# EAGLE schematic SSI2131-Proto-PCB (EAGLE 7.5.0)
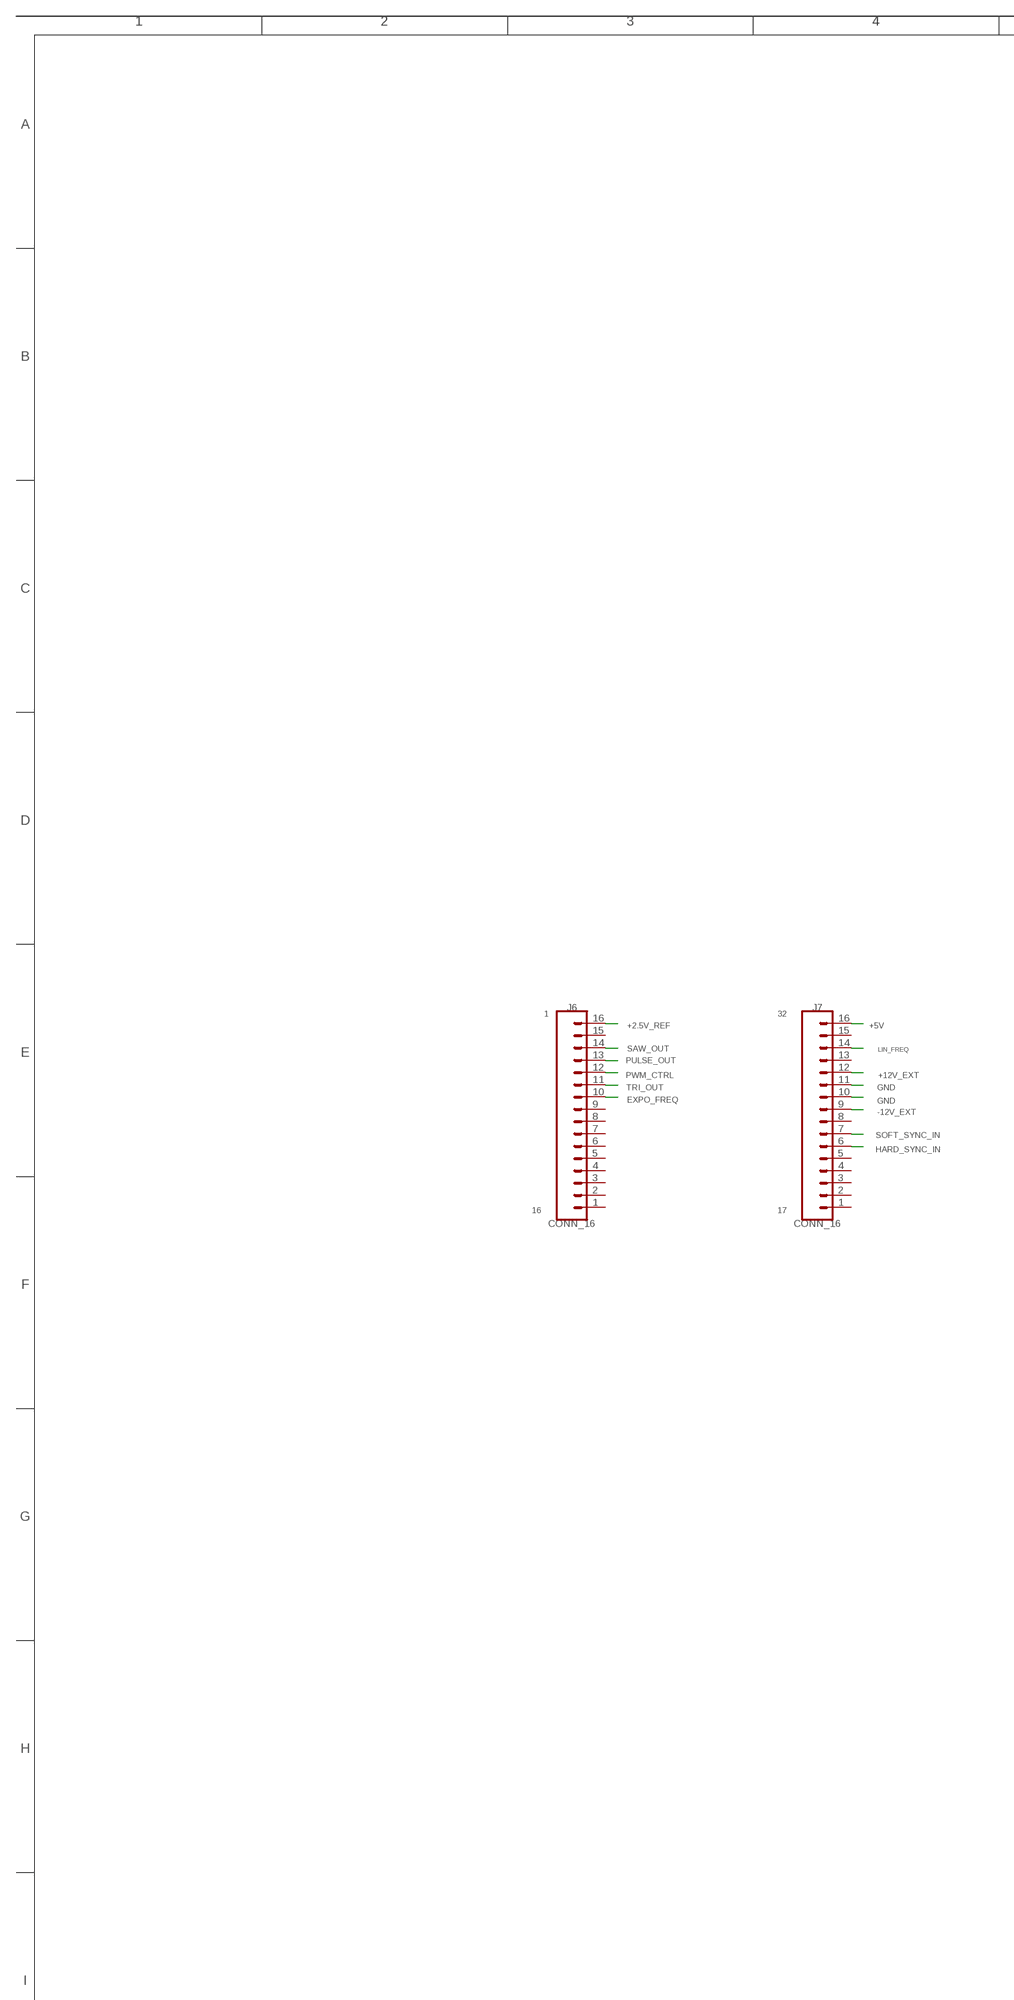
[diagram p0: schematic, sheet 1, part 1 of 2]
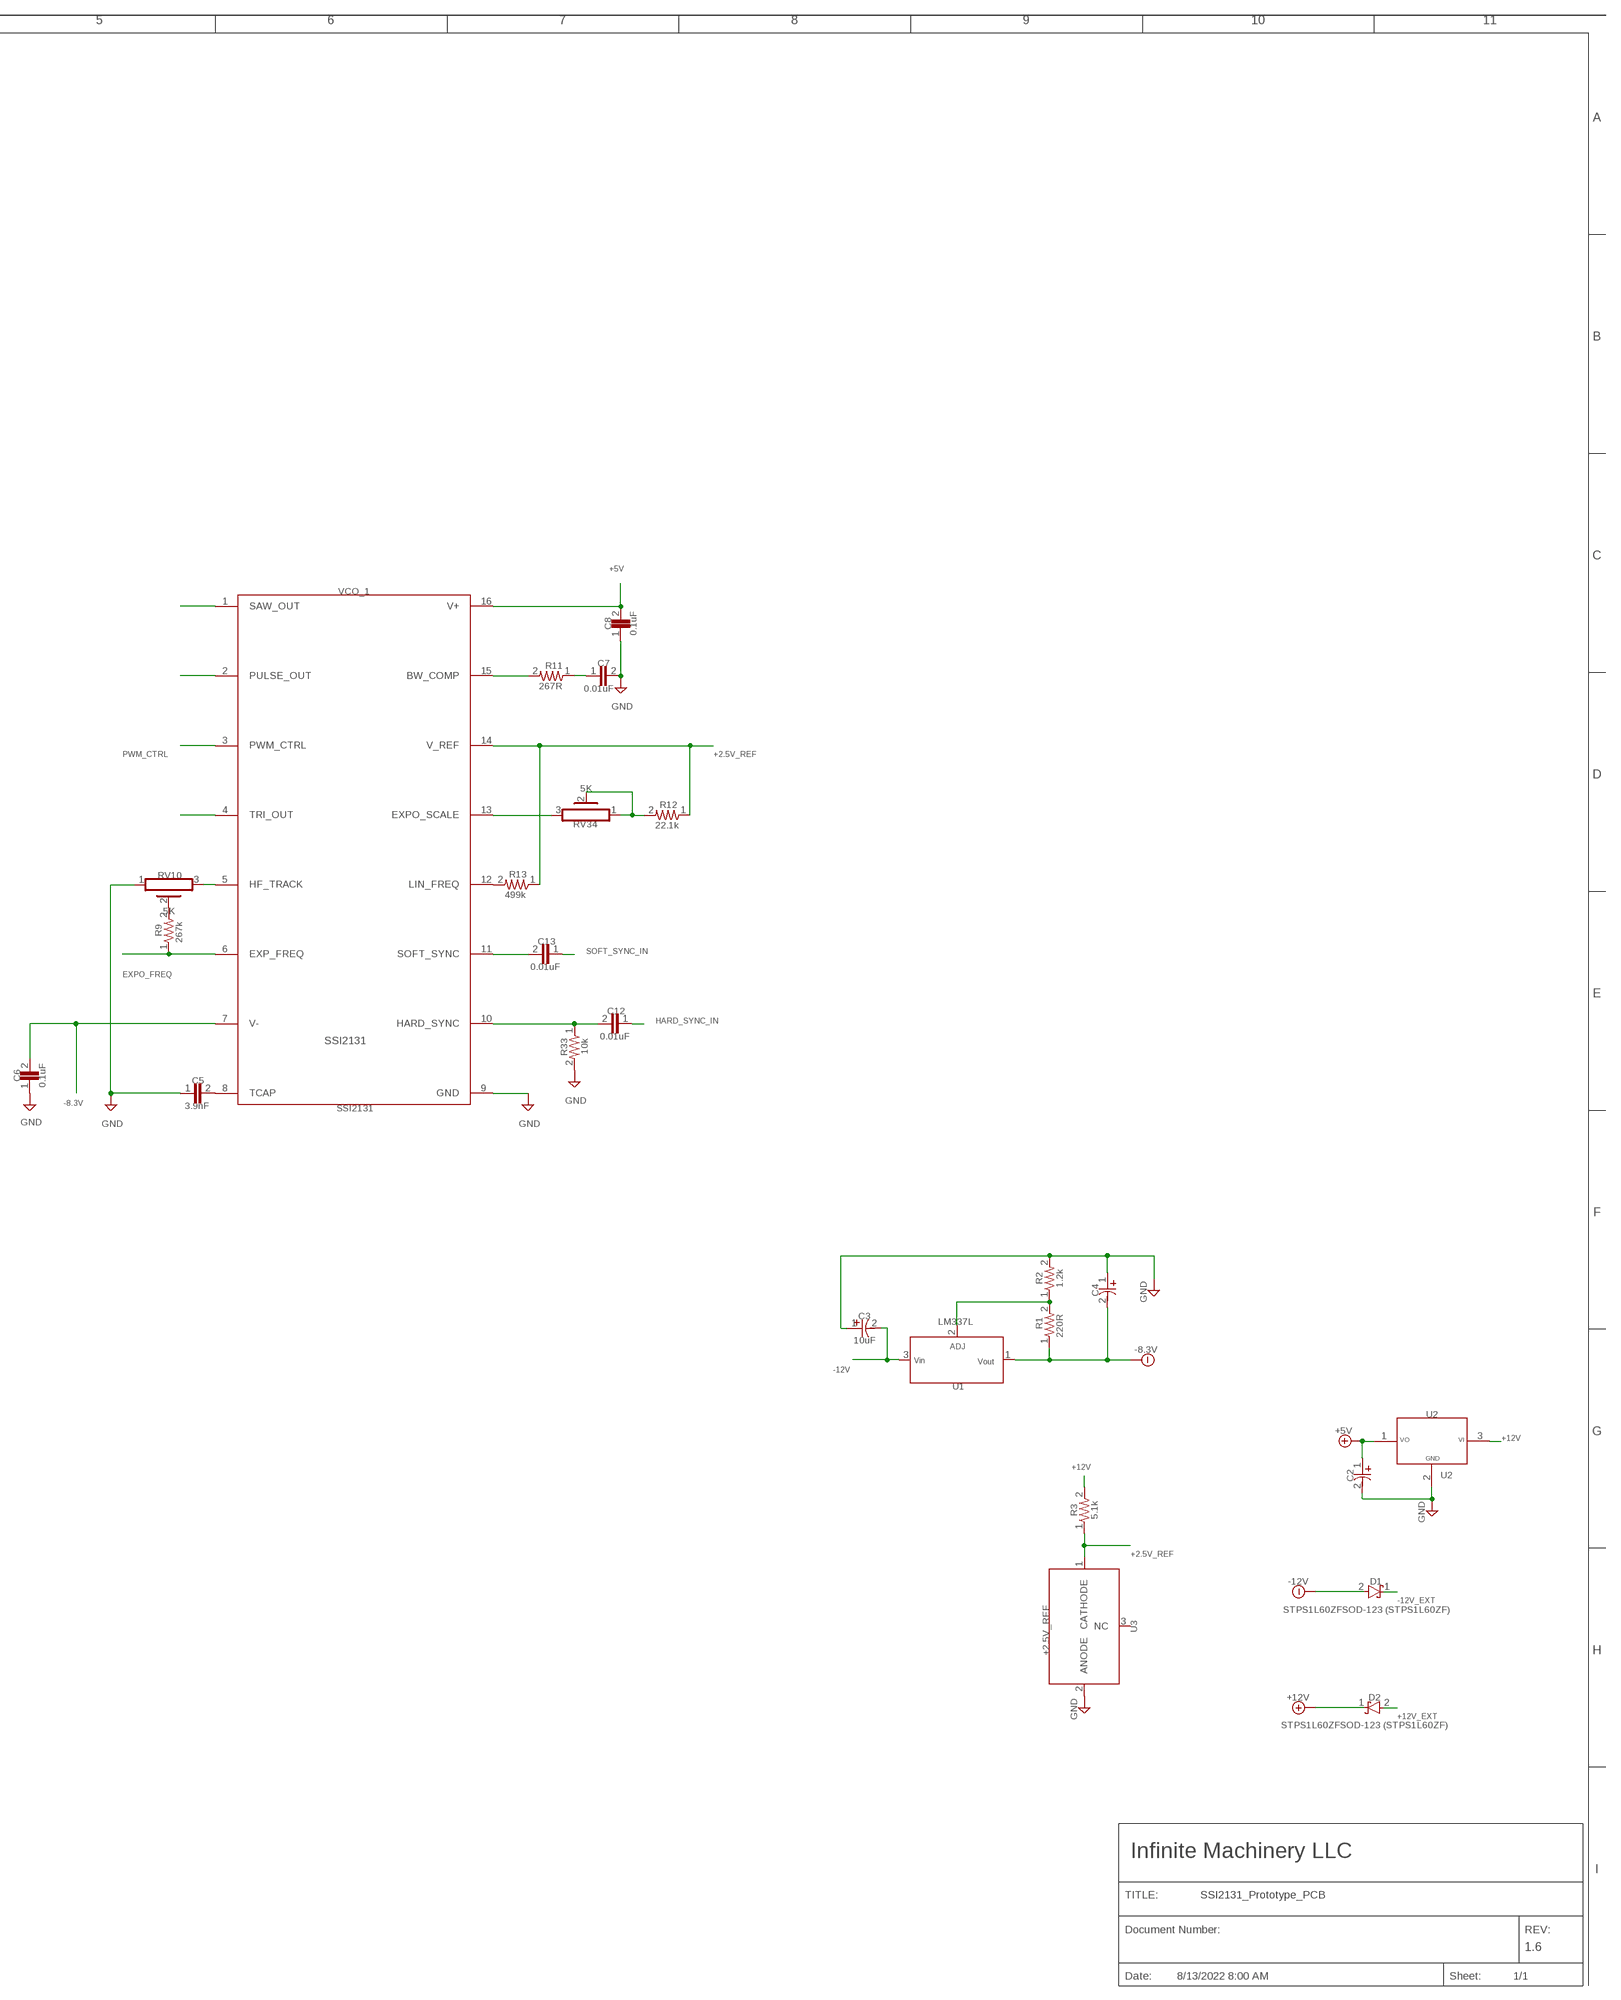
[diagram p1: schematic, sheet 1, part 2 of 2]

## Parts
+2.5V_REF  U3  LM4040  [SOT23]
C2  10uF  CAPAE_4.3X4.3H5.4  [CAPAE-4.3X4.3H5.4]
C3  10uF  CAPAE_4.3X4.3H5.4  [CAPAE-4.3X4.3H5.4]
C4  10uF  CAPAE_4.3X4.3H5.4  [CAPAE-4.3X4.3H5.4]
C5  3.9nF  C-EU050-025X075_(C-EU)  [C050-025X075]
C6  0.1uF  C-EUC0603_(C-EU)  [C0603]
C7  0.01uF  C-EUC0603_(C-EU)  [C0603]
C8  0.1uF  C-EUC0603_(C-EU)  [C0603]
C12  0.01uF  C-EUC0603_(C-EU)  [C0603]
C13  0.01uF  C-EUC0603_(C-EU)  [C0603]
D1  STPS1L60ZFSOD-123_(STPS1L60ZF)  [SOD3516X98N]
D2  STPS1L60ZFSOD-123_(STPS1L60ZF)  [SOD3516X98N]
J6  CONN_16  [1X16]
J7  CONN_16  [1X16]
R1  220R  R-US_R0603_(R-US_)  [R0603]
R2  1.2k  R-US_R0603_(R-US_)  [R0603]
R3  5.1k  R-US_R0603_(R-US_)  [R0603]
R9  267k  R-US_R0603_(R-US_)  [R0603]
R11  267R  R-US_R0603_(R-US_)  [R0603]
R12  22.1k  R-US_R0603_(R-US_)  [R0603]
R13  499k  R-US_R0603_(R-US_)  [R0603]
R33  10k  R-US_R0603_(R-US_)  [R0603]
RV10  5K  PV36Y_(PV36)  [PV36Y]
RV34  5K  PV36Y_(PV36)  [PV36Y]
U1  LM337L  [TO-92-LM337L]
U2  U2  UA78L05CLP-FL  [TO-92-FL]
VCO_1  SSI2131  [SOIC127P620X175-16N]

## Nets
+2.5V_REF: +2.5V_REF.1(CATHODE) J6.16 R3.1 R12.1 R13.1 VCO_1.14(V_REF)
+5V: C2.1(PLUS) C8.2 J7.16 U2.1(VO) VCO_1.16(V+)
+12V: D2.1(C) R3.2 U2.3(VI)
+12V_EXT: D2.2(A) J7.12
-8.3V: C4.2(MINUS) C6.2 R1.1 U1.1(VOUT) VCO_1.7(V-)
-12V: C3.2(MINUS) D1.2(A) U1.3(VIN)
-12V_EXT: D1.1(C) J7.9
BW_COMP: R11.2 VCO_1.15(BW_COMP)
EXPO_FREQ: J6.10 R9.1 VCO_1.6(EXP_FREQ)
EXPO_SCALE: RV34.3 VCO_1.13(EXPO_SCALE)
GND: +2.5V_REF.2(ANODE) C2.2(MINUS) C3.1(PLUS) C4.1(PLUS) C5.1 C6.1 C7.2 C8.1 J7.10 J7.11 R2.2 R33.2 RV10.1 U2.2(GND) VCO_1.9(GND)
HARD_SYNC: C12.2 R33.1 VCO_1.10(HARD_SYNC)
HARD_SYNC_IN: C12.1 J7.6
HF_TRACK: RV10.3 VCO_1.5(HF_TRACK)
LIN_FREQ: J7.14 R13.2 VCO_1.12(LIN_FREQ)
N$3: C7.1 R11.1
N$4: R1.2 R2.1 U1.2(ADJ)
N$21: R9.2 RV10.2
N$22: R12.2 RV34.1 RV34.2
PULSE_OUT: J6.13 VCO_1.2(PULSE_OUT)
PWM_CTRL: J6.12 VCO_1.3(PWM_CTRL)
SAW_OUT: J6.14 VCO_1.1(SAW_OUT)
SOFT_SYNC: C13.2 VCO_1.11(SOFT_SYNC)
SOFT_SYNC_IN: C13.1 J7.7
TCAP: C5.2 VCO_1.8(TCAP)
TRI_OUT: J6.11 VCO_1.4(TRI_OUT)
Unconnected: +2.5V_REF.3(NC) J6.1 J6.2 J6.3 J6.4 J6.5 J6.6 J6.7 J6.8 J6.9 J6.15 J7.1 J7.2 J7.3 J7.4 J7.5 J7.8 J7.13 J7.15

## Notes on the sheet
- 1 | 2 | 3 | 4 | 5 | 6 | 7 | 8 | 9 | 10 | 11
- A | A
- B | B
- C | C
- +5V
- VCO_1
- C8
- 0.1uF
- R11 | C7
- 267R | 0.01uF
- GND
- PWM_CTRL | +2.5V_REF
- D | D
- 5K
- R12
- RV34 | 22.1k
- RV10 | R13
- 499k
- 5K
- R9
- 267k | C13
- 1 | J6 | 32 | J7 | SOFT_SYNC_IN
- 0.01uF
- +2.5V_REF | +5V
- EXPO_FREQ
- E | E
- SAW_OUT | LIN_FREQ
- PULSE_OUT
- C12
- PWM_CTRL | +12V_EXT
- HARD_SYNC_IN
- TRI_OUT | GND
- 0.01uF
- EXPO_FREQ | GND
- SSI2131
- -12V_EXT | 10k
- R33
- SOFT_SYNC_IN
- C6 | C5
- HARD_SYNC_IN | 0.1uF
- 3.9nF | SSI2131 | GND
- -8.3V
- GND | GND | GND
- 16 | 17
- CONN_16 | CONN_16
- F | F
- R2
- 1.2k
- C4
- GND
- C3
- LM337L
- R1
- 10uF | 220R
- ADJ
- -8.3V
- Vin | Vout
- -12V
- U1
- U2
- G | G
- +5V
- VO | VI
- +12V
- GND
- +12V | U2
- C2
- R3
- 5.1k
- GND
- +2.5V_REF
- -12V | D1
- -12V_EXT
- STPS1L60ZFSOD-123 (STPS1L60ZF)
- U3
- H | H
- +2.5V_REF
- +12V | D2
- GND | +12V_EXT
- STPS1L60ZFSOD-123 (STPS1L60ZF)
- Infinite Machinery LLC
- I | I
- TITLE: | SSI2131_Prototype_PCB
- Document Number: | REV:
- 1.6
- Date: | 8/13/2022 8:00 AM | Sheet: | 1/1

## Library data of the parts
+2.5V_REF = common:LM4040
C2-C4 = common:CAPAE_4.3X4.3H5.4; UNIQUE_NAME: CAPAE-4.3x4.3h5.4
C5 = common:C-EU050-025X075_(C-EU); SPICEPREFIX: C
C6 C8 = common:C-EUC0603_(C-EU); SPICEPREFIX: C
C7 C12 C13 = common:C-EUC0603_(C-EU); SPICEPREFIX: C; VALUE: 0.1uF
D1 D2 = common:STPS1L60ZFSOD-123_(STPS1L60ZF)
J6 J7 = common:CONN_16
R1 = common:R-US_R0603_(R-US_); SPICEPREFIX: R
R2 R3 R9 R11-R13 R33 = common:R-US_R0603_(R-US_); SPICEPREFIX: R; VALUE: 220R
RV10 RV34 = common:PV36Y_(PV36); CATEGORY: Resistor; DESCRIPTION: Lead Sealed Type Multiturn PV36 Series; MANUFACTURER: BOURNS; MPN: PV36Y; OPERATING_TEMPERATURE: -55 to +125 °C; PART_STATUS: Active; ROHS_COMPLIANCE: ROHS Compliant; SERIES: PV36; SUB-CATEGORY: Trimpot; TYPE: Lead Sealed
U1 = common:LM337L
U2 = common:UA78L05CLP-FL
VCO_1 = common:SSI2131